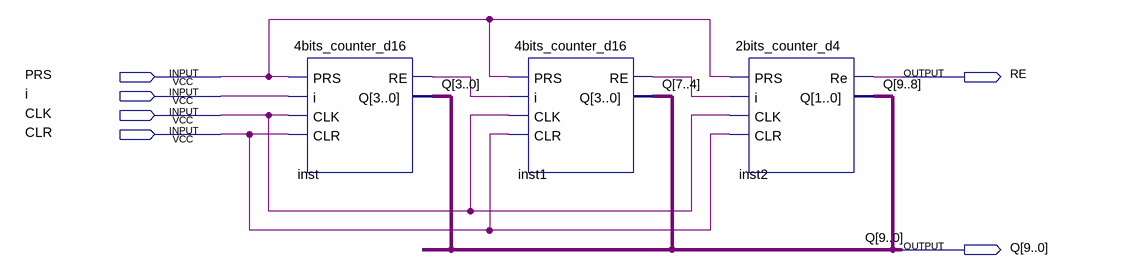
[diagram p0: schematic sheet]
// Quartus schematic 10bits_counter_d1024.bdf as structural Verilog: 3 symbols, 6 pins
module \10bits_counter_d1024  (
  input  PRS,
  input  i,
  input  CLK,
  input  CLR,
  output RE,
  output [9:0] Q
);

  wire inst1_re, inst_re;

  \4bits_counter_d16  inst (.PRS(PRS), .i(i), .CLK(CLK), .CLR(CLR), .RE(inst_re), .Q(Q[3:0]));
  \4bits_counter_d16  inst1 (.PRS(PRS), .i(inst_re), .CLK(CLK), .CLR(CLR), .RE(inst1_re), .Q(Q[7:4]));
  \2bits_counter_d4  inst2 (.PRS(PRS), .i(inst1_re), .CLK(CLK), .CLR(CLR), .Re(RE), .Q(Q[9:8]));
endmodule
